# EAGLE design v2 (EAGLE 9.6.2)
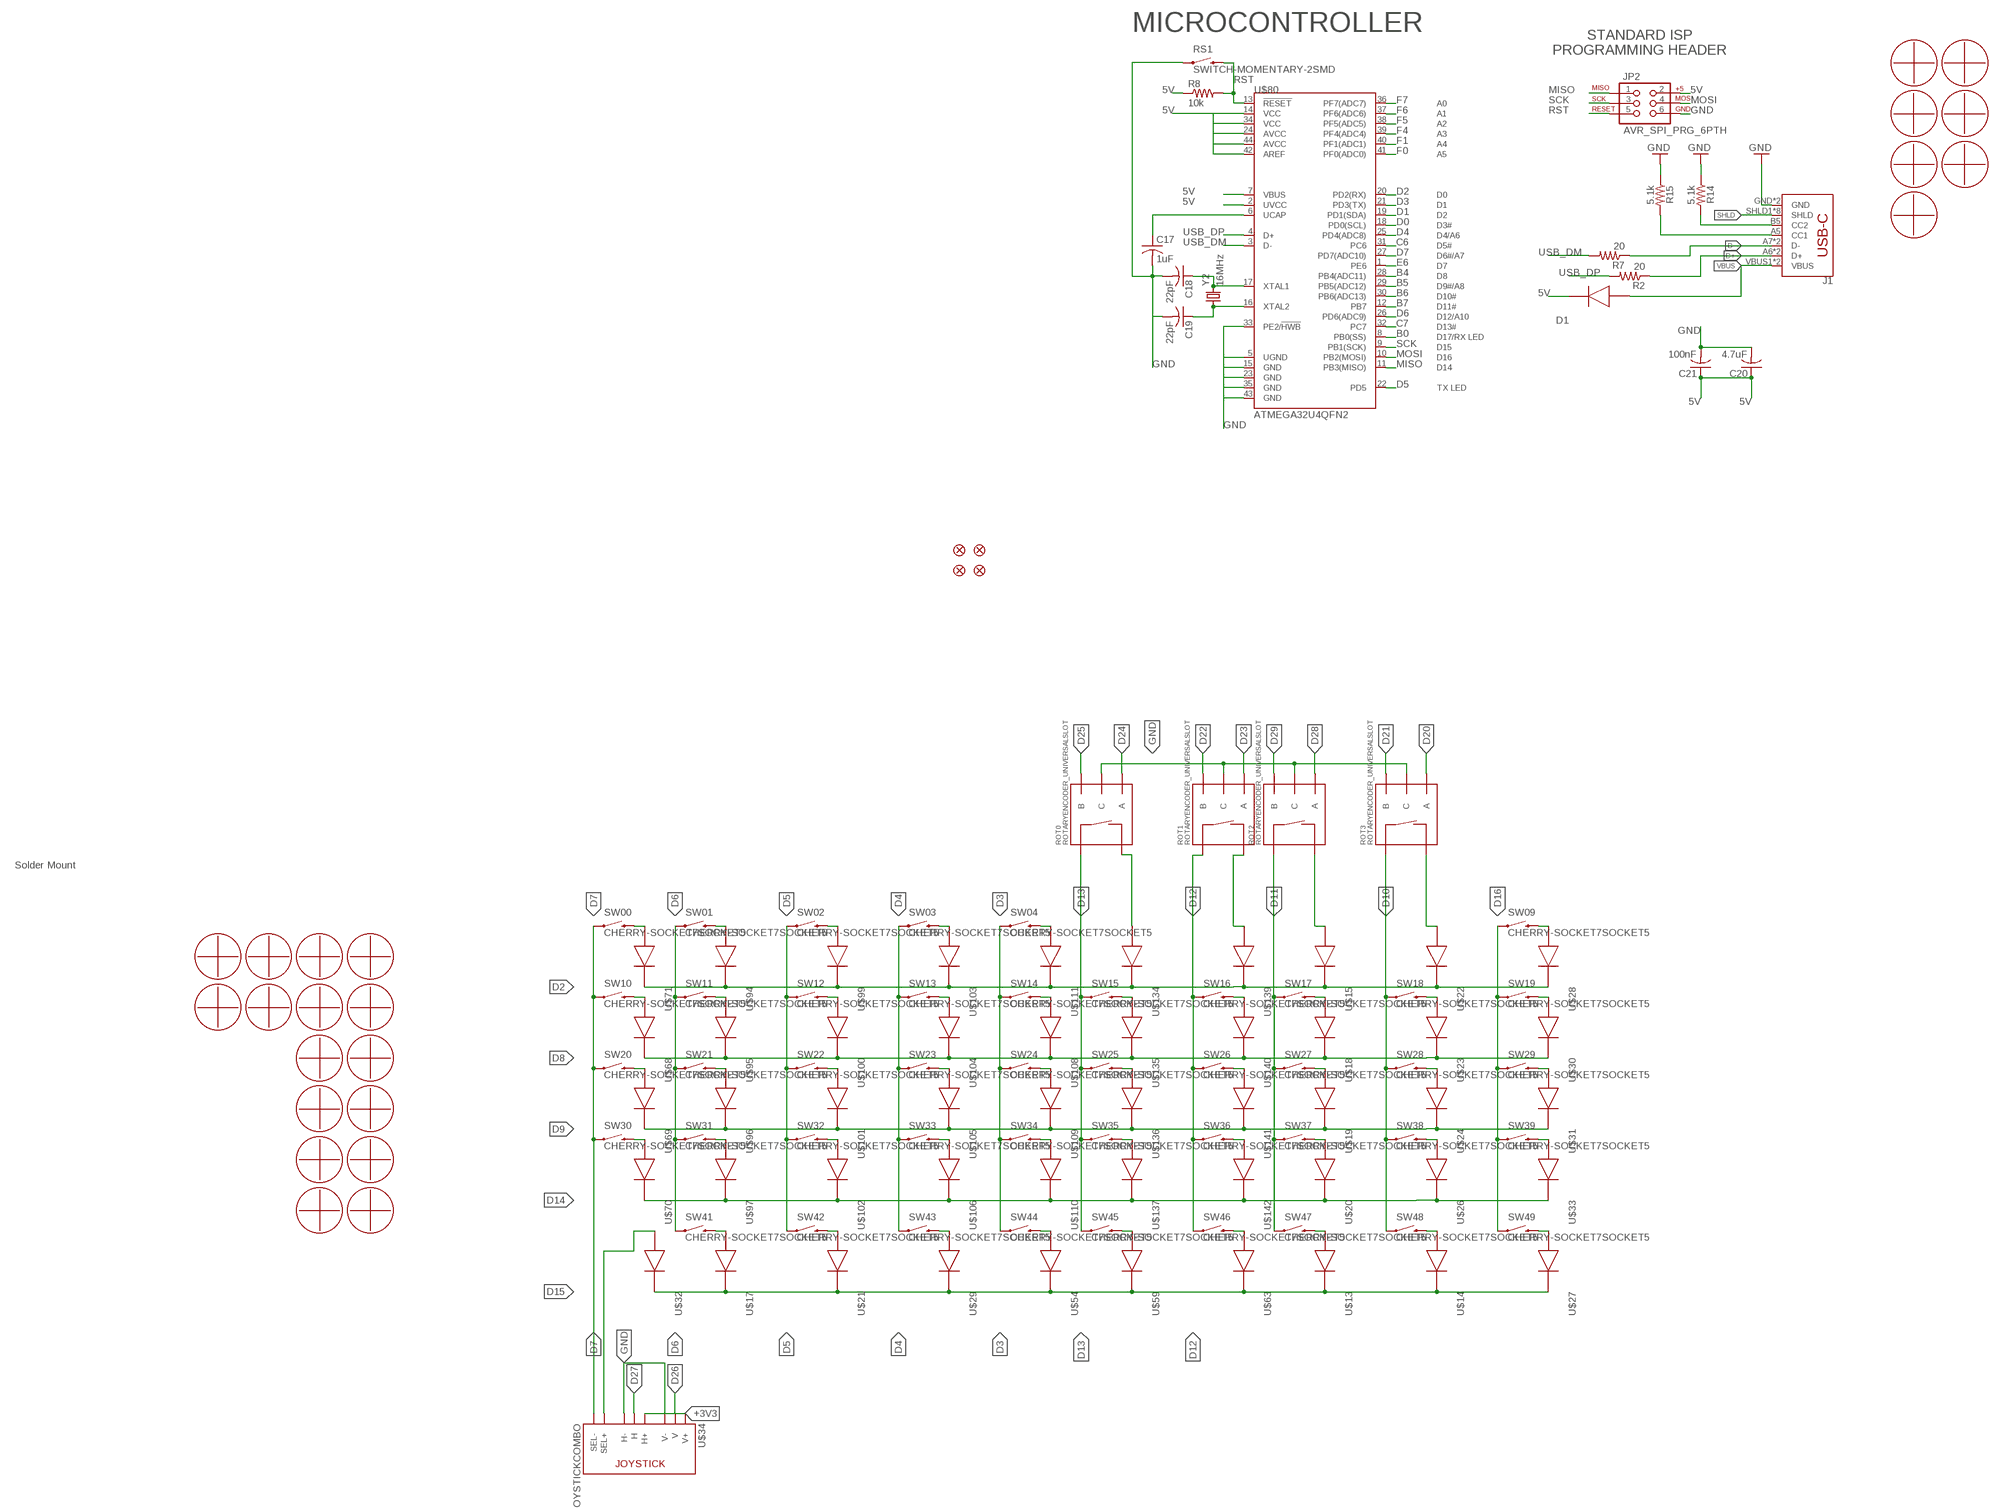
[diagram p0: schematic, sheet 1]

## Parts
C17  1uF  C-USC0603  [C0603]
C18  22pF  C-USC0603  [C0603]
C19  22pF  C-USC0603  [C0603]
C20  4.7uF  C-USC0603  [C0603]
C21  100nF  C-USC0603  [C0603]
D1  SCHOTTKY  [SOD-123]
J1  USB_C16PIN  [USB-C-16P]
JP2  AVR_SPI_PRG_6PTH  [2X3]
R2  20  R-US_R0603  [R0603]
R7  20  R-US_R0603  [R0603]
R8  10k  R-US_R0603  [R0603]
R14  5.1k  5.1KOHM5.1KOHM-0603-1/10W-1%  [0603]
R15  5.1k  5.1KOHM5.1KOHM-0603-1/10W-1%  [0603]
ROT0  ROTARYENCODER_UNIVERSALSLOT  [ROTARY_ENC_SLOT]
ROT1  ROTARYENCODER_UNIVERSALSLOT  [ROTARY_ENC_SLOT]
ROT2  ROTARYENCODER_UNIVERSALSLOT  [ROTARY_ENC_SLOT]
ROT3  ROTARYENCODER_UNIVERSALSLOT  [ROTARY_ENC_SLOT]
RS1  SWITCH-MOMENTARY-2SMD  [TACTILE_SWITCH_SMD]
SW00  CHERRY-SOCKET7SOCKET5  [CHERRY-SOCKET5]
SW01  CHERRY-SOCKET7SOCKET5  [CHERRY-SOCKET5]
SW02  CHERRY-SOCKET7SOCKET5  [CHERRY-SOCKET5]
SW03  CHERRY-SOCKET7SOCKET5  [CHERRY-SOCKET5]
SW04  CHERRY-SOCKET7SOCKET5  [CHERRY-SOCKET5]
SW09  CHERRY-SOCKET7SOCKET5  [CHERRY-SOCKET5]
SW10  CHERRY-SOCKET7SOCKET5  [CHERRY-SOCKET5]
SW11  CHERRY-SOCKET7SOCKET5  [CHERRY-SOCKET5]
SW12  CHERRY-SOCKET7SOCKET5  [CHERRY-SOCKET5]
SW13  CHERRY-SOCKET7SOCKET5  [CHERRY-SOCKET5]
SW14  CHERRY-SOCKET7SOCKET5  [CHERRY-SOCKET5]
SW15  CHERRY-SOCKET7SOCKET5  [CHERRY-SOCKET5]
SW16  CHERRY-SOCKET7SOCKET5  [CHERRY-SOCKET5]
SW17  CHERRY-SOCKET7SOCKET5  [CHERRY-SOCKET5]
SW18  CHERRY-SOCKET7SOCKET5  [CHERRY-SOCKET5]
SW19  CHERRY-SOCKET7SOCKET5  [CHERRY-SOCKET5]
SW20  CHERRY-SOCKET7SOCKET5  [CHERRY-SOCKET5]
SW21  CHERRY-SOCKET7SOCKET5  [CHERRY-SOCKET5]
SW22  CHERRY-SOCKET7SOCKET5  [CHERRY-SOCKET5]
SW23  CHERRY-SOCKET7SOCKET5  [CHERRY-SOCKET5]
SW24  CHERRY-SOCKET7SOCKET5  [CHERRY-SOCKET5]
SW25  CHERRY-SOCKET7SOCKET5  [CHERRY-SOCKET5]
SW26  CHERRY-SOCKET7SOCKET5  [CHERRY-SOCKET5]
SW27  CHERRY-SOCKET7SOCKET5  [CHERRY-SOCKET5]
SW28  CHERRY-SOCKET7SOCKET5  [CHERRY-SOCKET5]
SW29  CHERRY-SOCKET7SOCKET5  [CHERRY-SOCKET5]
SW30  CHERRY-SOCKET7SOCKET5  [CHERRY-SOCKET5]
SW31  CHERRY-SOCKET7SOCKET5  [CHERRY-SOCKET5]
SW32  CHERRY-SOCKET7SOCKET5  [CHERRY-SOCKET5]
SW33  CHERRY-SOCKET7SOCKET5  [CHERRY-SOCKET5]
SW34  CHERRY-SOCKET7SOCKET5  [CHERRY-SOCKET5]
SW35  CHERRY-SOCKET7SOCKET5  [CHERRY-SOCKET5]
SW36  CHERRY-SOCKET7SOCKET5  [CHERRY-SOCKET5]
SW37  CHERRY-SOCKET7SOCKET5  [CHERRY-SOCKET5]
SW38  CHERRY-SOCKET7SOCKET5  [CHERRY-SOCKET5]
SW39  CHERRY-SOCKET7SOCKET5  [CHERRY-SOCKET5]
SW41  CHERRY-SOCKET7SOCKET5  [CHERRY-SOCKET5]
SW42  CHERRY-SOCKET7SOCKET5  [CHERRY-SOCKET5]
SW43  CHERRY-SOCKET7SOCKET5  [CHERRY-SOCKET5]
SW44  CHERRY-SOCKET7SOCKET5  [CHERRY-SOCKET5]
SW45  CHERRY-SOCKET7SOCKET5  [CHERRY-SOCKET5]
SW46  CHERRY-SOCKET7SOCKET5  [CHERRY-SOCKET5]
SW47  CHERRY-SOCKET7SOCKET5  [CHERRY-SOCKET5]
SW48  CHERRY-SOCKET7SOCKET5  [CHERRY-SOCKET5]
SW49  CHERRY-SOCKET7SOCKET5  [CHERRY-SOCKET5]
U$1  M2MOUNT  [M2MOUNT]
U$2  M2MOUNT  [M2MOUNT]
U$3  M2MOUNT  [M2MOUNT]
U$4  M2MOUNT  [M2MOUNT]
U$5  M2MOUNT  [M2MOUNT]
U$6  M2MOUNT  [M2MOUNT]
U$7  M2MOUNT  [M2MOUNT]
U$8  M2MOUNT  [M2MOUNT]
U$9  M2MOUNT  [M2MOUNT]
U$10  M2MOUNT  [M2MOUNT]
U$11  M2MOUNT  [M2MOUNT]
U$12  M2MOUNT  [M2MOUNT]
U$13  1N4148WS  [SOD-323SLIM]
U$14  1N4148WS  [SOD-323SLIM]
U$15  1N4148WS  [SOD-323SLIM]
U$16  M2MOUNT  [M2MOUNT]
U$17  1N4148WS  [SOD-323SLIM]
U$18  1N4148WS  [SOD-323SLIM]
U$19  1N4148WS  [SOD-323SLIM]
U$20  1N4148WS  [SOD-323SLIM]
U$21  1N4148WS  [SOD-323SLIM]
U$22  1N4148WS  [SOD-323SLIM]
U$23  1N4148WS  [SOD-323SLIM]
U$24  1N4148WS  [SOD-323SLIM]
U$25  M2MOUNT  [M2MOUNT]
U$26  1N4148WS  [SOD-323SLIM]
U$27  1N4148WS  [SOD-323SLIM]
U$28  1N4148WS  [SOD-323SLIM]
U$29  1N4148WS  [SOD-323SLIM]
U$30  1N4148WS  [SOD-323SLIM]
U$31  1N4148WS  [SOD-323SLIM]
U$32  1N4148WS  [SOD-323SLIM]
U$33  1N4148WS  [SOD-323SLIM]
U$34  JOYSTICKCOMBO  [JOYSTICKCOMBO]
U$35  M2MOUNT3.65HOLE  [M2SOLDERC2916348]
U$36  M2MOUNT3.65HOLE  [M2SOLDERC2916348]
U$37  M2MOUNT3.65HOLE  [M2SOLDERC2916348]
U$38  FIDUCIAL_1MM  [FIDUCIAL_1MM]
U$39  FIDUCIAL_1MM  [FIDUCIAL_1MM]
U$40  M2MOUNT3.65HOLE  [M2SOLDERC2916348]
U$41  M2MOUNT3.65HOLE  [M2SOLDERC2916348]
U$42  M2MOUNT3.65HOLE  [M2SOLDERC2916348]
U$43  M2MOUNT3.65HOLE  [M2SOLDERC2916348]
U$44  M2MOUNT  [M2MOUNT]
U$45  M2MOUNT  [M2MOUNT]
U$54  1N4148WS  [SOD-323SLIM]
U$59  1N4148WS  [SOD-323SLIM]
U$62  FIDUCIAL_1MM  [FIDUCIAL_1MM]
U$63  1N4148WS  [SOD-323SLIM]
U$64  FIDUCIAL_1MM  [FIDUCIAL_1MM]
U$68  1N4148WS  [SOD-323SLIM]
U$69  1N4148WS  [SOD-323SLIM]
U$70  1N4148WS  [SOD-323SLIM]
U$71  1N4148WS  [SOD-323SLIM]
U$80  ATMEGA32U4QFN2  [QFN-44-NOPAD]
U$94  1N4148WS  [SOD-323SLIM]
U$95  1N4148WS  [SOD-323SLIM]
U$96  1N4148WS  [SOD-323SLIM]
U$97  1N4148WS  [SOD-323SLIM]
U$99  1N4148WS  [SOD-323SLIM]
U$100  1N4148WS  [SOD-323SLIM]
U$101  1N4148WS  [SOD-323SLIM]
U$102  1N4148WS  [SOD-323SLIM]
U$103  1N4148WS  [SOD-323SLIM]
U$104  1N4148WS  [SOD-323SLIM]
U$105  1N4148WS  [SOD-323SLIM]
U$106  1N4148WS  [SOD-323SLIM]
U$108  1N4148WS  [SOD-323SLIM]
U$109  1N4148WS  [SOD-323SLIM]
U$110  1N4148WS  [SOD-323SLIM]
U$111  1N4148WS  [SOD-323SLIM]
U$134  1N4148WS  [SOD-323SLIM]
U$135  1N4148WS  [SOD-323SLIM]
U$136  1N4148WS  [SOD-323SLIM]
U$137  1N4148WS  [SOD-323SLIM]
U$139  1N4148WS  [SOD-323SLIM]
U$140  1N4148WS  [SOD-323SLIM]
U$141  1N4148WS  [SOD-323SLIM]
U$142  1N4148WS  [SOD-323SLIM]
Y2  16MHz  CRYSTAL  [RESONATOR3225]

## Nets
5V: C20.1 C21.1 D1.CAT JP2.2 R8.1 U$80.2(UVCC) U$80.7(VBUS) U$80.14(VCC) U$80.24(AVCC) U$80.34(VCC) U$80.42(AREF) U$80.44(AVCC)
+3V3: U$34.H1(H+) U$34.HS1(H+) U$34.V1(V+) U$34.VS1(V+)
B0: U$80.8(PB0(SS))
B4: U$80.28(PB4(ADC11))
B5: U$80.29(PB5(ADC12))
B6: U$80.30(PB6(ADC13))
B7: U$80.12(PB7)
C6: U$80.31(PC6)
C7: U$80.32(PC7)
CC3: J1.A5(CC1) R15.2
CC4: J1.B5(CC2) R14.2
D0: U$80.18(PD0(SCL))
D1: U$80.19(PD1(SDA))
D2: U$15.GND(CAT) U$22.GND(CAT) U$28.GND(CAT) U$71.GND(CAT) U$80.20(PD2(RX)) U$94.GND(CAT) U$99.GND(CAT) U$103.GND(CAT) U$111.GND(CAT) U$134.GND(CAT) U$139.GND(CAT)
D3: SW04.A SW14.A SW24.A SW34.A SW44.A U$80.21(PD3(TX))
D4: SW03.A SW13.A SW23.A SW33.A SW43.A U$80.25(PD4(ADC8))
D5: SW02.A SW12.A SW22.A SW32.A SW42.A U$80.22(PD5)
D6: SW01.A SW11.A SW21.A SW31.A SW41.A U$80.26(PD6(ADC9))
D7: SW00.A SW10.A SW20.A SW30.A U$34.B1B1(SEL-) U$34.B1B(SEL-) U$34.B2B1(SEL-) U$34.B2B(SEL-) U$80.27(PD7(ADC10))
D8: U$18.GND(CAT) U$23.GND(CAT) U$30.GND(CAT) U$68.GND(CAT) U$95.GND(CAT) U$100.GND(CAT) U$104.GND(CAT) U$108.GND(CAT) U$135.GND(CAT) U$140.GND(CAT)
D9: U$19.GND(CAT) U$24.GND(CAT) U$31.GND(CAT) U$69.GND(CAT) U$96.GND(CAT) U$101.GND(CAT) U$105.GND(CAT) U$109.GND(CAT) U$136.GND(CAT) U$141.GND(CAT)
D10: ROT3.SW+ SW18.A SW28.A SW38.A SW48.A
D11: ROT2.SW+ SW17.A SW27.A SW37.A SW47.A
D12: ROT1.SW+ SW16.A SW26.A SW36.A SW46.A
D13: ROT0.SW+ SW15.A SW25.A SW35.A SW45.A
D14: U$20.GND(CAT) U$26.GND(CAT) U$33.GND(CAT) U$70.GND(CAT) U$97.GND(CAT) U$102.GND(CAT) U$106.GND(CAT) U$110.GND(CAT) U$137.GND(CAT) U$142.GND(CAT)
D15: U$13.GND(CAT) U$14.GND(CAT) U$17.GND(CAT) U$21.GND(CAT) U$27.GND(CAT) U$29.GND(CAT) U$32.GND(CAT) U$54.GND(CAT) U$59.GND(CAT) U$63.GND(CAT)
D16: SW09.A SW19.A SW29.A SW39.A SW49.A
D20: ROT3.A
D21: ROT3.B
D22: ROT1.B
D23: ROT1.A
D24: ROT0.A
D25: ROT0.B
D26: U$34.V2(V) U$34.VS2(V)
D27: U$34.H2(H) U$34.HS2(H)
D28: ROT2.A
D29: ROT2.B
D+: J1.A6(D+) J1.B6(D+) R2.1
D-: J1.A7(D-) J1.B7(D-) R7.1
E6: U$80.1(PE6)
F0: U$80.41(PF0(ADC0))
F1: U$80.40(PF1(ADC1))
F4: U$80.39(PF4(ADC4))
F5: U$80.38(PF5(ADC5))
F6: U$80.37(PF6(ADC6))
F7: U$80.36(PF7(ADC7))
GND: C17.2 C18.2 C19.2 C20.2 C21.2 J1.GND J1.GND2(GND) JP2.6 R14.1 R15.1 ROT0.C ROT1.C ROT2.C ROT3.C RS1.1 U$34.H3(H-) U$34.HS3(H-) U$34.V3(V-) U$34.VS3(V-) U$80.5(UGND) U$80.15(GND) U$80.23(GND) U$80.33(PE2/!HWB) U$80.35(GND) U$80.43(GND)
MISO: JP2.1 U$80.11(PB3(MISO))
MOSI: JP2.4 U$80.10(PB2(MOSI))
N$1: U$32.SIGNAL(ANO) U$34.B1A1(SEL+) U$34.B1A(SEL+) U$34.B2A1(SEL+) U$34.B2A(SEL+)
N$2: SW47.B U$13.SIGNAL(ANO)
N$3: SW48.B U$14.SIGNAL(ANO)
N$4: ROT2.SW- U$15.SIGNAL(ANO)
N$5: SW17.B U$18.SIGNAL(ANO)
N$6: SW27.B U$19.SIGNAL(ANO)
N$7: SW37.B U$20.SIGNAL(ANO)
N$8: SW41.B U$17.SIGNAL(ANO)
N$9: ROT3.SW- U$22.SIGNAL(ANO)
N$10: SW18.B U$23.SIGNAL(ANO)
N$11: SW28.B U$24.SIGNAL(ANO)
N$12: SW38.B U$26.SIGNAL(ANO)
N$13: SW49.B U$27.SIGNAL(ANO)
N$14: SW09.B U$28.SIGNAL(ANO)
N$15: SW42.B U$21.SIGNAL(ANO)
N$16: SW19.B U$30.SIGNAL(ANO)
N$17: SW29.B U$31.SIGNAL(ANO)
N$18: SW39.B U$33.SIGNAL(ANO)
N$19: SW00.B U$71.SIGNAL(ANO)
N$21: SW43.B U$29.SIGNAL(ANO)
N$22: SW44.B U$54.SIGNAL(ANO)
N$25: C17.1 U$80.6(UCAP)
N$27: SW45.B U$59.SIGNAL(ANO)
N$31: SW10.B U$68.SIGNAL(ANO)
N$32: SW20.B U$69.SIGNAL(ANO)
N$33: SW30.B U$70.SIGNAL(ANO)
N$34: SW46.B U$63.SIGNAL(ANO)
N$42: SW01.B U$94.SIGNAL(ANO)
N$43: SW11.B U$95.SIGNAL(ANO)
N$44: SW21.B U$96.SIGNAL(ANO)
N$45: SW31.B U$97.SIGNAL(ANO)
N$47: SW02.B U$99.SIGNAL(ANO)
N$48: SW12.B U$100.SIGNAL(ANO)
N$49: SW22.B U$101.SIGNAL(ANO)
N$50: SW32.B U$102.SIGNAL(ANO)
N$51: SW14.B U$108.SIGNAL(ANO)
N$52: SW24.B U$109.SIGNAL(ANO)
N$53: SW34.B U$110.SIGNAL(ANO)
N$54: SW03.B U$103.SIGNAL(ANO)
N$55: SW13.B U$104.SIGNAL(ANO)
N$56: SW23.B U$105.SIGNAL(ANO)
N$57: SW33.B U$106.SIGNAL(ANO)
N$61: SW04.B U$111.SIGNAL(ANO)
N$62: ROT0.SW- U$134.SIGNAL(ANO)
N$63: SW15.B U$135.SIGNAL(ANO)
N$64: SW25.B U$136.SIGNAL(ANO)
N$65: SW35.B U$137.SIGNAL(ANO)
N$67: ROT1.SW- U$139.SIGNAL(ANO)
N$68: SW16.B U$140.SIGNAL(ANO)
N$69: SW26.B U$141.SIGNAL(ANO)
N$70: SW36.B U$142.SIGNAL(ANO)
RST: JP2.5 R8.2 RS1.3 U$80.13(!RESET)
SCK: JP2.3 U$80.9(PB1(SCK))
SHLD: J1.SHLD1(SHLD) J1.SHLD2(SHLD) J1.SHLD3(SHLD) J1.SHLD4(SHLD) J1.SHLD5(SHLD) J1.SHLD6(SHLD) J1.SHLD7(SHLD) J1.SHLD8(SHLD)
USB_DM: R7.2 U$80.3(D-)
USB_DP: R2.2 U$80.4(D+)
VBUS: D1.ANO J1.VBUS1(VBUS) J1.VBUS2(VBUS)
XTAL1: C18.1 U$80.17(XTAL1) Y2.P3
XTAL2: C19.1 U$80.16(XTAL2) Y2.P1

## Notes on the sheet
- MICROCONTROLLER
- STANDARD ISP
  PROGRAMMING HEADER
- Solder Mount

## Library data of the parts
C17-C21 = adafruit:C-US: CAPACITOR, American symbol
D1 = GardnerCustom:SCHOTTKY
J1 = SparkFun-Connectors:USB_C: USB Type C 16Pin Connector Super Speed pins not available on the 16-pin purely SMD connector so this part is best for USB 2.0 implementations. D1 and D2 are tied together enabling D+/- no matter which way the cable is plugged into the connector. The two channel configuration pins (CC1/2) are exposed. These are normally connected to ground via 5.1k resistors but can be reconfigured for high current/high power applications.; PROD_ID: CONN-14122
JP2 = SparkFun-Connectors:AVR_SPI_PRG_6: AVR ISP 6 Pin This is the reduced ISP connector for AVR programming. Common on Arduino. This footprint will take up less PCB space and can be used with a 10-pin to 6-pin adapter such as SKU: BOB-08508 **Special note about "TEST_POINT" package. The stop mask is on the top side, so if you want your programming test points to be on the bottom of your board, make sure to place this package on the bottom side of the board. This also ensure that the orientation to program from the bottom side will be correct.
R2 R7 R8 = adafruit:R-US_: RESISTOR, American symbol
R14 R15 = SparkFun-Resistors:5.1KOHM; PROD_ID: RES-12083
ROT0 ROT1-ROT3 = GardnerCustom:ROTARYENCODER_UNIVERSAL
RS1 = GardnerCustom:SWITCH-MOMENTARY-2: Various NO switches- pushbuttons, reed, etc; PROD_ID: SWCH-08247
SW00 SW01-SW04 SW09 SW10-SW39 SW41-SW49 = GardnerCustom:CHERRY-SOCKET7
U$1-U$12 U$16 U$25 U$35-U$37 U$40-U$45 = GardnerCustom:M2MOUNT
U$13-U$15 U$17-U$24 U$26-U$33 U$54 U$59 U$63 U$68-U$71 U$94-U$97 U$99-U$106 U$108-U$111 U$134-U$137 U$139-U$142 = GardnerCustom:1N4148WS
U$34 = GardnerCustom:JOYSTICKCOMBO
U$38 U$39 U$62 U$64 = microbuilder:FIDUCIAL: Fiducial Alignment Points Various fiducial points for machine vision alignment.; BOM: EXCLUDE
U$80 = GardnerCustom:ATMEGA32U4: Atmel 44-pin 8-bit Microcontroller with 32KBytes of ISP Flash and USB Controller
Y2 = GardnerCustom:CRYSTAL: Various standard crystals. Proven footprints.

## Net classes
0 default: width 0.203 mm
1 power: width 0.305 mm

## Board
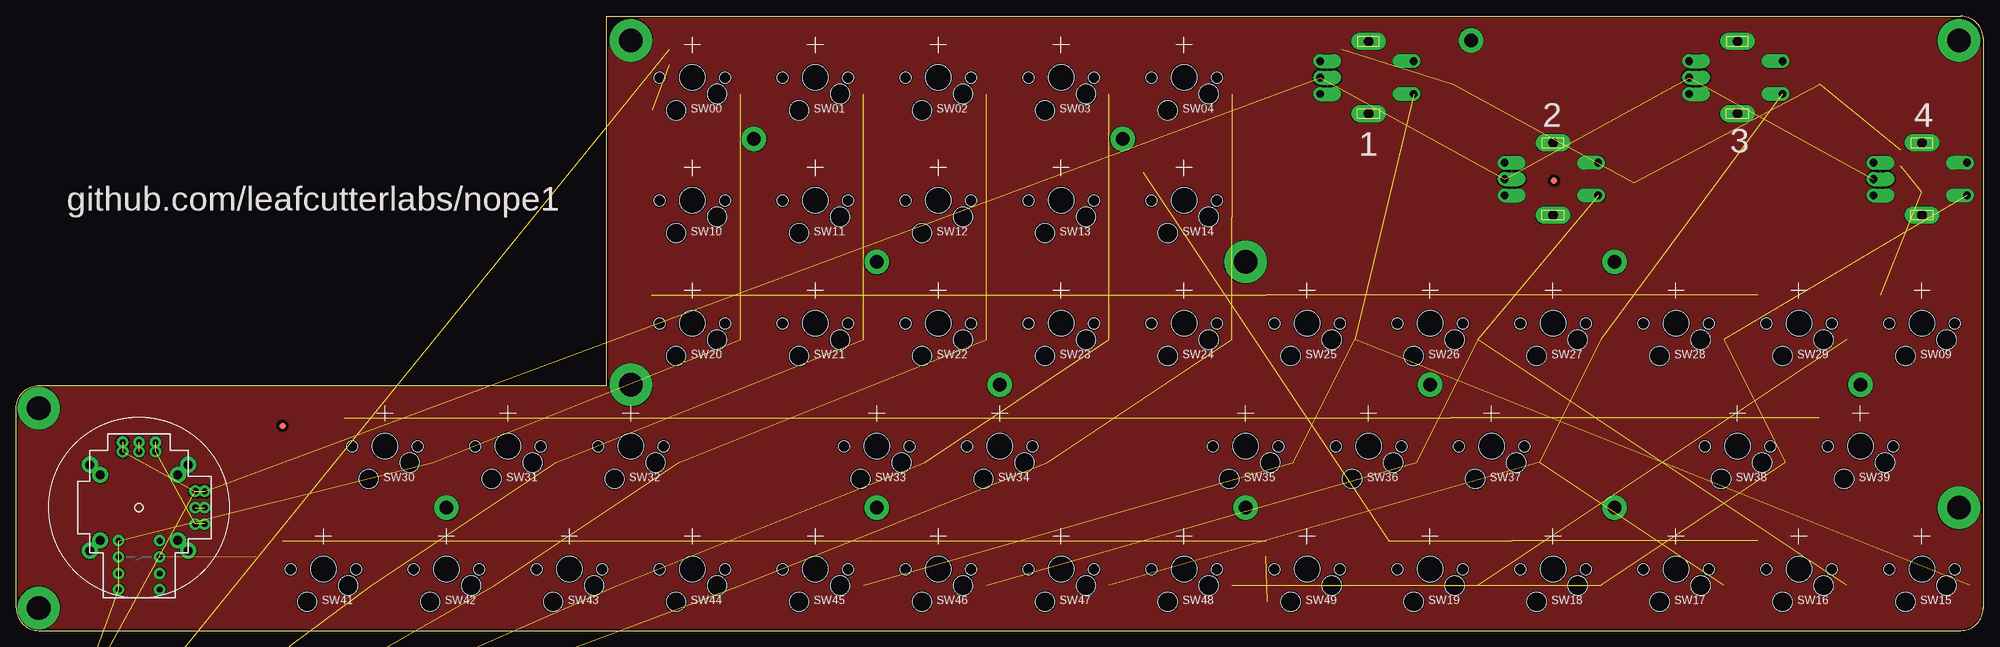
[diagram p1: board, top side]
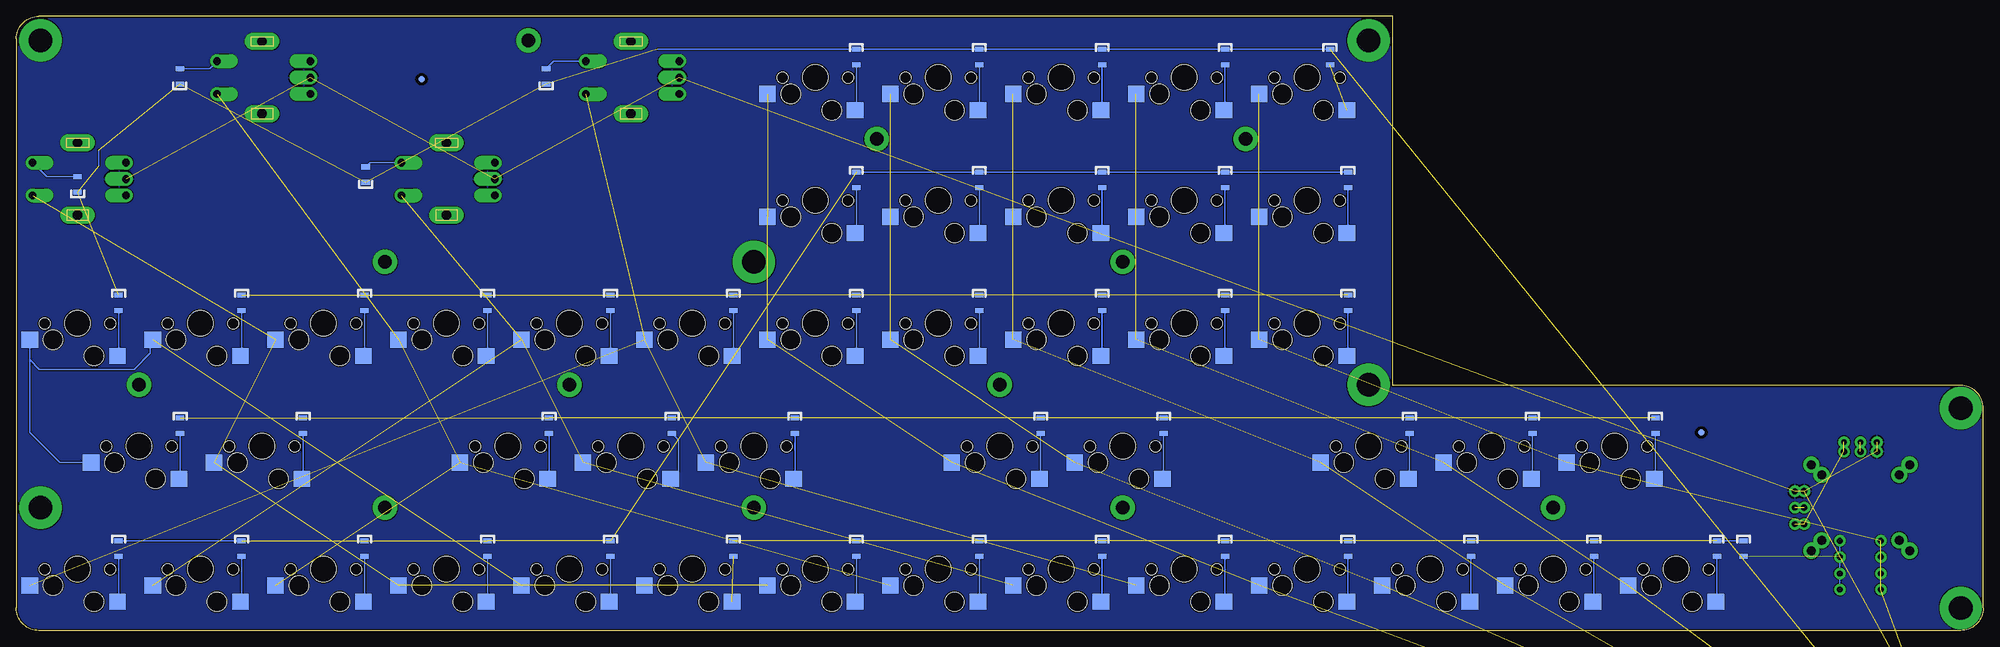
[diagram p2: board, bottom side, seen from below]

Size 304.8 x 95.25 mm. Coordinates in mm from the lower left corner, seen from the top.
Outline: 0,3.5 0,34.5 arc-90 3.5,38 91.5,38 91.5,95.25 301.3,95.25 arc-90 304.8,91.75 304.8,3.5 arc-90 301.3,0 3.5,0 arc-90 0,3.5
Copper layers (1*16): Top 0.035mm / dielectric 1.6mm / Bottom 0.035mm
Design rules "jlcpcb-2layers": minimum track width 5mil, minimum drill 0.3mm, track to track 5mil, track to pad 5mil, pad to pad 5mil, via to via 5mil, smd to smd 5mil, copper to edge 0.2mm, drill to drill 6mil, minimum pad ring 10mil, minimum via ring 3mil, stop-mask expansion 4mil, vias tented up to drill 0mil, thermal gap 10mil

### Footprints (pad centres in the part's own frame; a part is rotated, then mirrored left to right if it is on the bottom)
C0603 = smd 1.1 x 1: 1 -0.85,0; 2 0.85,0
SOD-123 = smd 0.9 x 0.95: ANO 1.575,0; CAT -1.575,0
USB-C-16P = smd 0.3 x 1.45: A5 -1.25,0; A6 -0.25,0; A7 0.25,0; A8 1.25,0; B5 1.75,0; B6 0.75,0; B7 -0.75,0; B8 -1.75,0 | smd 0.6 x 1.45: GND -3.225,0; GND2 3.225,0 | smd 1 x 2.1: SHLD1 -4.32,-0.915; SHLD2 4.32,-0.915 | smd 1 x 2.1 bottom: SHLD3 -4.32,-0.915; SHLD4 4.32,-0.915 | smd 1 x 1.6: SHLD5 -4.32,-5.095; SHLD8 4.32,-5.095 | smd 1 x 1.6 bottom: SHLD6 -4.32,-5.095; SHLD7 4.32,-5.095 | smd 0.55 x 1.45: VBUS1 -2.45,0; VBUS2 2.45,0 | hole 0.65: -2.89,-1.445; 2.89,-1.445
2X3 = drill 1.016 pad 1.88 octagon: 1 0,0; 2 0,2.54; 3 2.54,0; 4 2.54,2.54; 5 5.08,0; 6 5.08,2.54
R0603 = smd 1 x 1.1: 1 -0.85,0; 2 0.85,0
0603 = smd 1.1 x 1: 1 -0.85,0; 2 0.85,0
ROTARY_ENC_SLOT = drill 1.2 pad 1.6 offset: A 7.493,-2.54; B 7.493,2.54; C 7.493,0; SW+ -6.985,2.54; SW- -6.985,-2.54 | drill 1.5 long: P$3 0,5.6; P$4 0,-5.6
TACTILE_SWITCH_SMD = smd 1.6 x 0.9: 1 -2.9,1.905; 2 2.9,1.905; 3 -2.9,-1.905; 4 2.9,-1.905
CHERRY-SOCKET5 = smd 2.6 x 2.5 bottom: A -7.435,2.54; B 6.165,5.08 | hole 4: 0,0 | hole 3: -3.81,2.54; 2.54,5.08 | hole 1.753: -5.08,0; 5.08,0
M2MOUNT = drill 2.1 pad 3.5: P$1 0,0
SOD-323SLIM = smd 0.8 x 1.35: GND 1.2,0; SIGNAL -1.2,0
JOYSTICKCOMBO = drill 0.9 pad 1.778: B1A -3.175,12.7; B1A1 -3.175,10.2; B1B 3.175,12.7; B1B1 3.175,10.2; B2A -3.175,7.62; B2A1 -3.175,5.12; B2B 3.175,7.62; B2B1 3.175,5.12 | drill 0.889 pad 1.778: H1 -2.54,-10.16; H2 0,-10.16; H3 2.54,-10.16; V1 -10.16,2.54; V2 -10.16,0; V3 -10.16,-2.54 | drill 1 pad 1.5: HS1 -2.54,-8.7; HS2 0,-8.7; HS3 2.54,-8.7; VS1 -8.7,2.54; VS2 -8.7,0; VS3 -8.7,-2.54 | drill 1.397 pad 2.286: MOUNT1 -7.62,6.668; MOUNT2 -7.62,-6.668; MOUNT3 7.62,-6.668; MOUNT4 7.62,6.668; MOUNT5 -6.02,5.067; MOUNT6 6.02,5.067; MOUNT7 6.02,-5.067; MOUNT8 -6.02,-5.067
M2SOLDERC2916348 = drill 3.65 pad 6.2: P$1 0,0
FIDUCIAL_1MM = smd 1 x 1: 1 0,0
QFN-44-NOPAD = smd 0.8 x 0.3: 1 -3.4,2.5; 2 -3.4,2; 3 -3.4,1.5; 4 -3.4,1; 5 -3.4,0.5; 6 -3.4,0; 7 -3.4,-0.5; 8 -3.4,-1; 9 -3.4,-1.5; 10 -3.4,-2; 11 -3.4,-2.5; 23 3.4,-2.5; 24 3.4,-2; 25 3.4,-1.5; 26 3.4,-1; 27 3.4,-0.5; 28 3.4,0; 29 3.4,0.5; 30 3.4,1; 31 3.4,1.5; 32 3.4,2; 33 3.4,2.5 | smd 0.3 x 0.8: 12 -2.5,-3.4; 13 -2,-3.4; 14 -1.5,-3.4; 15 -1,-3.4; 16 -0.5,-3.4; 17 0,-3.4; 18 0.5,-3.4; 19 1,-3.4; 20 1.5,-3.4; 21 2,-3.4; 22 2.5,-3.4; 34 2.5,3.4; 35 2,3.4; 36 1.5,3.4; 37 1,3.4; 38 0.5,3.4; 39 0,3.4; 40 -0.5,3.4; 41 -1,3.4; 42 -1.5,3.4; 43 -2,3.4; 44 -2.5,3.4
RESONATOR3225 = smd 1.4 x 1.2: P1 -1.1,-0.85; P2 1.1,-0.85; P3 1.1,0.85; P4 -1.1,0.85

### Placement (x,y rotation side)
C17  13,-56.5 0 top  (outside the outline)
C18  2,-56.5 0 top  (outside the outline)
C19  7.5,-56.5 0 top  (outside the outline)
C20  -4,-56.5 0 top  (outside the outline)
C21  18.5,-51 0 top  (outside the outline)
D1  18,-55.5 0 top  (outside the outline)
J1  19,-39.5 0 top  (outside the outline)
JP2  -3.5,-44.5 0 top  (outside the outline)
R2  11.5,-51 0 top  (outside the outline)
R7  15,-51 0 top  (outside the outline)
R8  7.5,-51 0 top  (outside the outline)
R14  22,-55.5 0 top  (outside the outline)
R15  -4,-61 0 top  (outside the outline)
ROT0  209.55,85.72 180 top
ROT1  238.12,70 180 top
ROT2  266.7,85.72 180 top
ROT3  295.27,70 180 top
RS1  -1.5,-51 0 top  (outside the outline)
SW00  104.78,85.72 180 top
SW01  123.83,85.72 180 top
SW02  142.88,85.72 180 top
SW03  161.93,85.72 180 top
SW04  180.97,85.72 180 top
SW09  295.27,47.62 180 top
SW10  104.78,66.67 180 top
SW11  123.83,66.67 180 top
SW12  142.88,66.67 180 top
SW13  161.93,66.67 180 top
SW14  180.97,66.67 180 top
SW15  295.27,9.53 180 top
SW16  276.23,9.53 180 top
SW17  257.18,9.53 180 top
SW18  238.12,9.53 180 top
SW19  219.07,9.53 180 top
SW20  104.78,47.62 180 top
SW21  123.83,47.62 180 top
SW22  142.88,47.62 180 top
SW23  161.93,47.62 180 top
SW24  180.97,47.62 180 top
SW25  200.03,47.62 180 top
SW26  219.07,47.62 180 top
SW27  238.12,47.62 180 top
SW28  257.18,47.62 180 top
SW29  276.23,47.62 180 top
SW30  57.15,28.57 180 top
SW31  76.2,28.57 180 top
SW32  95.25,28.57 180 top
SW33  133.35,28.57 180 top
SW34  152.4,28.57 180 top
SW35  190.5,28.57 180 top
SW36  209.55,28.57 180 top
SW37  228.6,28.57 180 top
SW38  266.7,28.57 180 top
SW39  285.75,28.57 180 top
SW41  47.62,9.53 180 top
SW42  66.67,9.53 180 top
SW43  85.72,9.53 180 top
SW44  104.78,9.53 180 top
SW45  123.83,9.53 180 top
SW46  142.88,9.53 180 top
SW47  161.93,9.53 180 top
SW48  180.97,9.53 180 top
SW49  200.03,9.53 180 top
U$1  225.43,91.5 0 top
U$2  66.67,19.05 0 top
U$3  -3.5,-120.5 0 top  (outside the outline)
U$4  133.35,57.15 0 top
U$5  133.35,19.05 0 top
U$6  114.3,76.2 0 top
U$7  171.45,76.2 0 top
U$8  285.75,38.1 0 top
U$9  247.65,19.05 0 top
U$10  247.65,57.15 0 top
U$11  190.5,19.05 0 top
U$12  152.4,38.1 0 top
U$13  155.57,12.7 90 bottom
U$14  174.62,12.7 90 bottom
U$15  279.43,85.92 270 bottom
U$16  219.07,38.1 0 top
U$17  41.27,12.7 90 bottom
U$18  250.82,12.7 90 bottom
U$19  231.78,50.8 90 bottom
U$20  222.25,31.75 90 bottom
U$21  60.33,12.7 90 bottom
U$22  295.27,69.17 270 bottom
U$23  231.78,12.7 90 bottom
U$24  250.82,50.8 90 bottom
U$25  -3.5,-124.5 0 top  (outside the outline)
U$26  260.35,31.75 90 bottom
U$27  193.68,12.7 90 bottom
U$28  288.93,50.8 90 bottom
U$29  79.38,12.7 90 bottom
U$30  212.72,12.7 90 bottom
U$31  269.88,50.8 90 bottom
U$32  37.15,12.7 90 bottom
U$33  279.4,31.75 90 bottom
U$34  19.05,19.05 180 top
U$35  3.5,34.5 0 bottom
U$36  3.5,3.5 0 bottom
U$37  301,91.5 0 bottom
U$38  41.27,31.75 0 top
U$39  43.7,30.7 90 bottom
U$40  301,19.05 0 bottom
U$41  190.5,57.15 0 bottom
U$42  95.25,91.5 0 bottom
U$43  95.25,38.1 0 bottom
U$44  -3.5,-128.5 0 top  (outside the outline)
U$45  -3.5,-132.5 0 top  (outside the outline)
U$54  98.42,12.7 90 bottom
U$59  117.47,12.7 90 bottom
U$62  241.97,85.45 0 bottom
U$63  136.53,12.7 90 bottom
U$64  238.28,69.72 0 top
U$68  98.42,69.85 90 bottom
U$69  98.42,50.8 90 bottom
U$70  50.8,31.75 90 bottom
U$71  101.22,88.9 90 bottom
U$80  -1.5,-31.5 0 top  (outside the outline)
U$94  117.47,88.9 90 bottom
U$95  117.47,69.85 90 bottom
U$96  117.47,50.8 90 bottom
U$97  69.85,31.75 90 bottom
U$99  136.53,88.9 90 bottom
U$100  136.53,69.85 90 bottom
U$101  136.53,50.8 90 bottom
U$102  88.9,31.75 90 bottom
U$103  155.57,88.9 90 bottom
U$104  155.57,69.85 90 bottom
U$105  155.57,50.8 90 bottom
U$106  127,31.75 90 bottom
U$108  174.62,69.85 90 bottom
U$109  174.62,50.8 90 bottom
U$110  146.05,31.75 90 bottom
U$111  174.62,88.9 90 bottom
U$134  222.68,85.92 270 bottom
U$135  288.93,12.7 90 bottom
U$136  193.68,50.8 90 bottom
U$137  184.15,31.75 90 bottom
U$139  250.65,70.67 270 bottom
U$140  269.88,12.7 90 bottom
U$141  212.72,50.8 90 bottom
U$142  203.2,31.75 90 bottom
Y2  0,-61 0 top  (outside the outline)

### Tracks (layer width: path | path; a pad name or v marks a point on that pad's centre or on a via)
5V  (11 unrouted)
+3V3  (3 unrouted)
CC3  (1 unrouted)
CC4  (1 unrouted)
D2  (7 unrouted)
  Bottom 0.254: U$71.GND U$94.GND U$99.GND U$103.GND U$111.GND 205.4,90.1 | 292,72 292,74.5
D3  (5 unrouted)
D4  (5 unrouted)
D5  (5 unrouted)
D6  (5 unrouted)
D7  (8 unrouted)
D8  (4 unrouted)
  Bottom 0.254: U$68.GND U$95.GND U$100.GND U$104.GND U$108.GND | U$140.GND U$135.GND
D9  (9 unrouted)
D10  (4 unrouted)
D11  (4 unrouted)
D12  (4 unrouted)
D13  (4 unrouted)
D14  (9 unrouted)
D15  (8 unrouted)
  Bottom 0.254: U$32.GND U$17.GND
D16  (2 unrouted)
  Bottom 0.254: SW39.A 298.04,26.04 302.71,30.71 302.71,42 | 302.71,42 SW09.A | SW29.A 284,44.74 284,43 286.5,40.5 301.21,40.5 302.71,42
D26  (1 unrouted)
D27  (1 unrouted)
D+  (1 unrouted)
D-  (2 unrouted)
GND  (24 unrouted)
  pour Bottom: -5.6,102.2 317.2,102.2 317.2,-12 -5.6,-12
  pour Top: -3,107 312,107 312,-24.6 -3,-24.6
MISO  (1 unrouted)
MOSI  (1 unrouted)
N$1  (1 unrouted)
  Bottom 0.254: U$34.B2A1 U$34.B2A U$34.B1A1 U$34.B1A
N$2
  Bottom 0.254: SW47.B 155.57,4.63 U$13.SIGNAL
N$3
  Bottom 0.254: SW48.B 174.62,4.63 U$14.SIGNAL
N$4
  Bottom 0.254: ROT2.SW- 274.82,87.12 U$15.SIGNAL
N$5
  Bottom 0.254: SW17.B 250.82,4.63 U$18.SIGNAL
N$6
  Bottom 0.254: SW27.B 231.78,42.73 U$19.SIGNAL
N$7
  Bottom 0.254: SW37.B 222.25,23.68 U$20.SIGNAL
N$8
  Bottom 0.254: SW41.B 41.27,4.63 U$17.SIGNAL
N$9
  Bottom 0.254: ROT3.SW- 300.1,70.38 U$22.SIGNAL
N$10
  Bottom 0.254: SW18.B 231.78,4.63 U$23.SIGNAL
N$11
  Bottom 0.254: SW28.B 250.82,42.73 U$24.SIGNAL
N$12
  Bottom 0.254: SW38.B 260.35,23.68 U$26.SIGNAL
N$13  (1 unrouted)
N$14
  Bottom 0.254: SW09.B 288.93,42.73 U$28.SIGNAL
N$15
  Bottom 0.254: SW42.B 60.33,4.63 U$21.SIGNAL
N$16
  Bottom 0.254: SW19.B 212.72,4.63 U$30.SIGNAL
N$17
  Bottom 0.254: SW29.B 269.88,42.73 U$31.SIGNAL
N$18
  Bottom 0.254: SW39.B 279.4,23.68 U$33.SIGNAL
N$19  (1 unrouted)
N$21
  Bottom 0.254: SW43.B 79.38,4.63 U$29.SIGNAL
N$22
  Bottom 0.254: SW44.B 98.42,4.63 U$54.SIGNAL
N$25  (1 unrouted)
N$27
  Bottom 0.254: SW45.B 117.47,4.63 U$59.SIGNAL
N$31
  Bottom 0.254: SW10.B 98.42,61.78 U$68.SIGNAL
N$32
  Bottom 0.254: SW20.B 98.42,42.73 U$69.SIGNAL
N$33
  Bottom 0.254: SW30.B 50.8,23.68 U$70.SIGNAL
N$34
  Bottom 0.254: SW46.B 136.53,4.63 U$63.SIGNAL
N$42
  Bottom 0.254: SW01.B 117.47,80.83 U$94.SIGNAL
N$43
  Bottom 0.254: SW11.B 117.47,61.78 U$95.SIGNAL
N$44
  Bottom 0.254: SW21.B 117.47,42.73 U$96.SIGNAL
N$45
  Bottom 0.254: SW31.B 69.85,23.68 U$97.SIGNAL
N$47
  Bottom 0.254: SW02.B 136.53,80.83 U$99.SIGNAL
N$48
  Bottom 0.254: SW12.B 136.53,61.78 U$100.SIGNAL
N$49
  Bottom 0.254: SW22.B 136.53,42.73 U$101.SIGNAL
N$50
  Bottom 0.254: SW32.B 88.9,23.68 U$102.SIGNAL
N$51
  Bottom 0.254: SW14.B 174.62,61.78 U$108.SIGNAL
N$52
  Bottom 0.254: SW24.B 174.62,42.73 U$109.SIGNAL
N$53
  Bottom 0.254: SW34.B 146.05,23.68 U$110.SIGNAL
N$54
  Bottom 0.254: SW03.B 155.57,80.83 U$103.SIGNAL
N$55
  Bottom 0.254: SW13.B 155.57,61.78 U$104.SIGNAL
N$56
  Bottom 0.254: SW23.B 155.57,42.73 U$105.SIGNAL
N$57
  Bottom 0.254: SW33.B 127,23.68 U$106.SIGNAL
N$61
  Bottom 0.254: SW04.B 174.62,80.83 U$111.SIGNAL
N$62
  Bottom 0.254: ROT0.SW- 221.53,88.27 U$134.SIGNAL
N$63
  Bottom 0.254: SW15.B 288.93,4.63 U$135.SIGNAL
N$64
  Bottom 0.254: SW25.B 193.68,42.73 U$136.SIGNAL
N$65
  Bottom 0.254: SW35.B 184.15,23.68 U$137.SIGNAL
N$67
  Bottom 0.254: ROT1.SW- 249.99,72.54 U$139.SIGNAL
N$68
  Bottom 0.254: SW16.B 269.88,4.63 U$140.SIGNAL
N$69
  Bottom 0.254: SW26.B 212.72,42.73 U$141.SIGNAL
N$70
  Bottom 0.254: SW36.B 202.2,24.68 202.2,29.55 U$142.SIGNAL
RST  (3 unrouted)
SCK  (1 unrouted)
USB_DM  (1 unrouted)
USB_DP  (1 unrouted)
VBUS  (2 unrouted)
XTAL1  (2 unrouted)
XTAL2  (2 unrouted)

### Text on the board
tPlace: 2 | 4 | 1 | 3 | github.com/leafcutterlabs/nope1
bPlace: leafcutterlabs@gmail.com v.1 Dec- 23-2020